# Altium schematic sheet Zmena polarity.SchDoc
size A
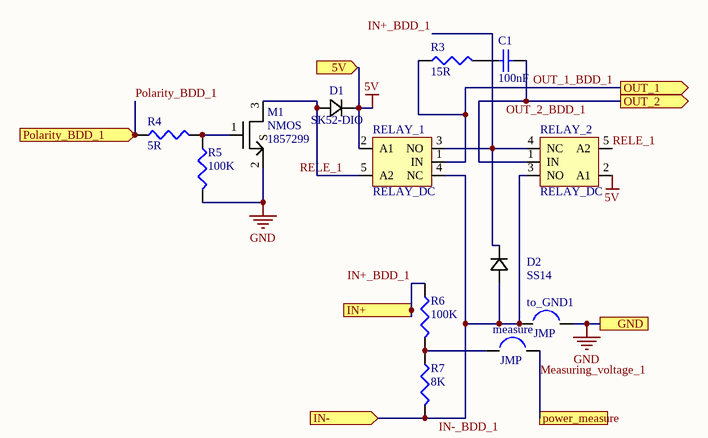
[diagram p0: Zmena polarity.SchDoc]

## Parts
C1  100nF  [1608[0603]]
D1  SK52-DIO  [D5A20V]
D2  SS14  [D5A20V]
M1  NMOS  Supplier Part Number 1: 1857299  [SOT23]
measure  JMP  [JMP]
R3  15R  [J1-0603]
R4  5R  [J1-0603]
R5  100K  [J1-0603]
R6  100K  [J1-0603]
R7  8K  [J1-0603]
RELAY_1  RELAY_DC  [RELAY_DC]
RELAY_2  RELAY_DC  [RELAY_DC]
to_GND1  JMP  [JMP]

## Ports
5V (in), GND, IN+ (in), IN- (in), OUT_1 (out), OUT_2 (out), Polarity_BDD_1 (in), power_measure

## Nets
5V: D1.1 RELAY_1.2(A1) RELAY_2.2(A1) ; port 5V
GND: M1.2(S) R5.2 to_GND1.2 ; port GND
IN+_BDD_1: D2.1 R6.1 RELAY_1.3(NO) RELAY_2.4(NC) ; port IN+
IN-_BDD_1: D2.2 R7.2 RELAY_1.4(NC) RELAY_2.3(NO) to_GND1.1 ; port IN-
Measuring_voltage_1: measure.2 ; port power_measure
OUT_1_BDD_1: R3.1 RELAY_1.1(IN) ; port OUT_1
OUT_2_BDD_1: C1.2 RELAY_2.1(IN) ; port OUT_2
Polarity_BDD_1: R4.1 ; port Polarity_BDD_1
RELE_1: D1.2 M1.3(D) RELAY_1.5(A2) RELAY_2.5(A2)
NetC1_1: C1.1 R3.2
NetM1_1: M1.1(G) R4.2 R5.1
Netmeasure_1: measure.1 R6.2 R7.1

## Library data of the parts
C1 = Cap Semi: Capacitor (Semiconductor SIM Model); Value: 100pF; Published: 8-Jun-2000; LatestRevisionDate: 29-May-2009; LatestRevisionNote: IPC-7351 Footprint Added.; PackageReference: C1206; Publisher: Altium Limited; PackageDescription: Chip Capacitor
D1 D2 = D_5A_20V
R3 = Res3: Resistor; Value: 2R; Published: 8-Jun-2000; LatestRevisionDate: 29-May-2009; LatestRevisionNote: IPC-7351 Footprint Added.; PackageReference: J1-0603; Publisher: Altium Limited; PackageDescription: Chip Resistor
R4-R7 = Res3: Resistor; Value: 200K; Published: 8-Jun-2000; LatestRevisionDate: 29-May-2009; LatestRevisionNote: IPC-7351 Footprint Added.; PackageReference: J1-0603; Publisher: Altium Limited; PackageDescription: Chip Resistor
RELAY_1 RELAY_2 = RELAY_DC: RM51-3011-85-1005
M1 = NMOS: Supplier 1: Farnell